# Altium schematic sheet 02 - Power.SchDoc: Power Supply
size A4; DrawnBy: Trevor Charmley; DocumentNumber: 4; Revision: 1; SheetNumber: 4; SheetTotal: 8
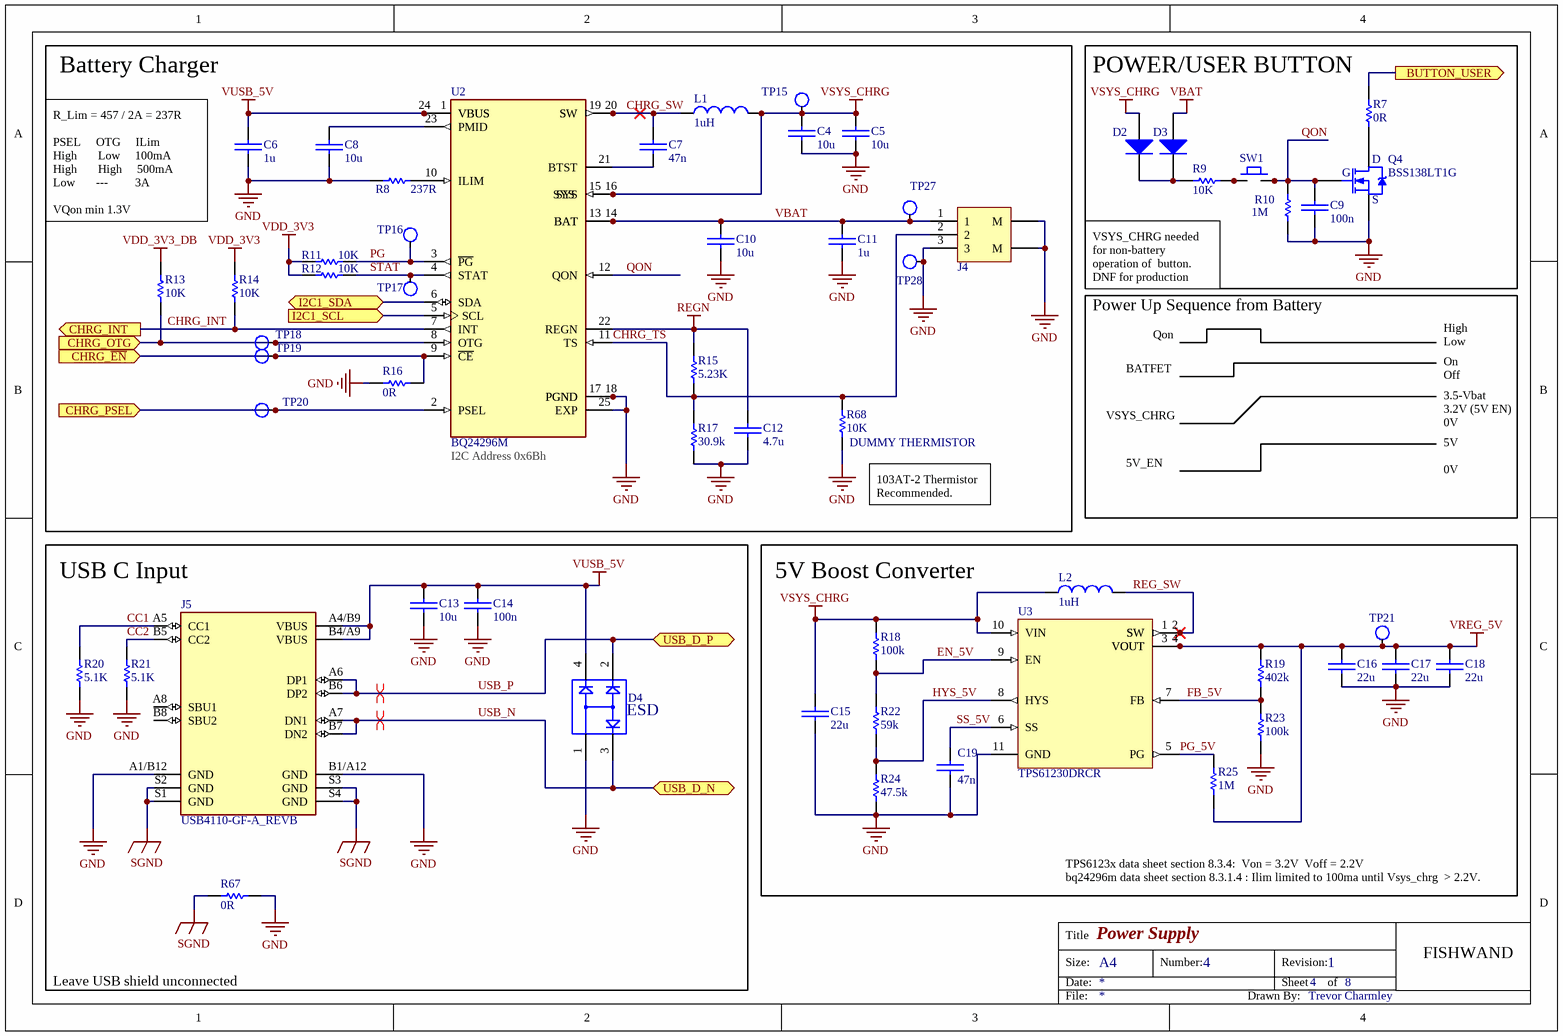
[diagram p0: 02 - Power.SchDoc]

## Parts
C4  10u  [CAPC100X50X65]
C5  10u  [CAPC100X50X65]
C6  1u  [CAPC100X50X65]
C7  47n  [CAPC100X50X65]
C8  10u  [CAPC100X50X65]
C9  100n  [CAPC100X50X65]
C10  10u  [CAPC100X50X65]
C11  1u  [CAPC100X50X65]
C12  4.7u  [CAPC100X50X65]
C13  10u  [CAPC100X50X65]
C14  100n  [CAPC100X50X65]
C15  22u  [CAPC200X125X140L45N]
C16  22u  [CAPC200X125X140L45N]
C17  22u  [CAPC200X125X140L45N]
C18  22u  [CAPC200X125X140L45N]
C19  47n  [CAPC100X50X65]
D2  Diode  [D_SOD_323F]  (value not drawn)
D3  Diode  [D_SOD_323F]  (value not drawn)
D4  SP0503BAHTG_8.5V_TVS_DIODE  [SOT143]  (value not drawn)
J4  BM03B-ADHKS-GAN-ETB  [J_JST_BM03B-ADHKS-GAN-ETB]  (value not drawn)
J5  USB4110-GF-A_REVB  [GCT_USB4110-GF-A_REVB]
L1  1uH  [IND1210]
L2  1uH  [IND1210]
Q4  BSS138LT1G  [SOT23-3P95_240X111L42X43N]
R7  0R  [RESC0402]
R8  237R  [RESC0402]
R9  10K  [RESC0402]
R10  1M  [RESC0402]
R11  10K  [RESC0402]
R12  10K  [RESC0402]
R13  10K  [RESC0402]
R14  10K  [RESC0402]
R15  5.23K  [RESC0402]
R16  0R  [RESC0402]
R17  30.9k  [RESC0402]
R18  100k  [RESC0402]
R19  402k  [RESC0402]
R20  5.1K  [RESC0402]
R21  5.1K  [RESC0402]
R22  59k  [RESC0402]
R23  100k  [RESC0402]
R24  47.5k  [RESC0402]
R25  1M  [RESC0402]
R67  0R  [RESC0402]
R68  10K  [RESC0402]
SW1  KSC621GLFS  [SW_KSC621GLFS]  (value not drawn)  (net tie)
TP15  Test Point  [tp_1mm]  (value not drawn)  (no BOM)
TP16  Test Point  [tp_1mm]  (value not drawn)  (no BOM)
TP17  Test Point  [tp_1mm]  (value not drawn)  (no BOM)
TP18  Test Point  [tp_1mm]  (value not drawn)  (no BOM)
TP19  Test Point  [tp_1mm]  (value not drawn)  (no BOM)
TP20  Test Point  [tp_1mm]  (value not drawn)  (no BOM)
TP21  Test Point  [tp_1mm]  (value not drawn)  (no BOM)
TP27  Test Point  [tp_1mm]  (value not drawn)  (no BOM)
TP28  Test Point  [tp_1mm]  (value not drawn)  (no BOM)
U2  BQ24296M  [QFN50P400X400X100-25N]
U3  TPS61230DRCR  [VREG_V62/16624-01YE]

## Blocks framed on the sheet
Battery Charger: C4-C8 C10-C12 J4 L1 R8 R11-R17 R68 TP15-TP20 TP27 TP28 U2
POWER/USER BUTTON: C9 D2 D3 Q4 R7 R9 R10 SW1
USB C Input: C13 C14 D4 J5 R20 R21 R67
5V Boost Converter: C15-C19 L2 R18 R19 R22-R25 TP21 U3

## Ports
BUTTON_USER (out), CHRG_INT (out), CHRG_OTG (in), CHRG_PSEL (in), CHRG_~{EN} (in), I2C1_SCL (in), I2C1_SDA (bidir), USB_D_N, USB_D_P

## Nets
GND: C4.2 C5.2 C6.2 C8.1 C9.2 C10.2 C11.2 C12.1 C13.2 C14.2 C15.1 C16.1 C17.1 C18.1 C19.2 D4.1 J4.0(M) J4.3 J5.A1/B12(GND) J5.B1/A12(GND) Q4.2(S) R8.1 R10.1 R16.1 R17.1 R20.1 R21.1 R23.1 R24.1 R67.2 R68.1 TP28.1 U2.17(PGND) U2.18(PGND) U2.25(EXP) U3.11(GND)
REGN: C12.2 R15.2 U2.22(REGN)
SGND: J5.S1(GND) J5.S2(GND) J5.S3(GND) J5.S4(GND) R67.1
VBAT: C10.1 C11.1 D3.2(A) J4.1 TP27.1 U2.13(BAT) U2.14(BAT)
VDD_3V3: R11.2 R12.2 R14.2
VDD_3V3_DB: R13.2
VREG_5V: C16.2 C17.2 C18.2 R19.2 R25.1 TP21.1 U3.3(VOUT) U3.4(VOUT)
VSYS_CHRG: C4.1 C5.1 C15.2 D2.2(A) L1.2 L2.1 R18.2 TP15.1 U2.15(SYS) U2.16(SYS) U3.10(VIN)
VUSB_5V: C6.1 C13.1 C14.1 D4.4 J5.A4/B9(VBUS) J5.B4/A9(VBUS) U2.1(VBUS) U2.24(VBUS)
BUTTON_USER: R7.1 ; port BUTTON_USER
CC1: J5.A5(CC1) R20.2
CC2: J5.B5(CC2) R21.2
CHRG_~{EN}: R16.2 TP19.1 U2.9(~{CE}) ; port CHRG_~{EN}
CHRG_INT: R14.1 U2.7(INT) ; port CHRG_INT
CHRG_OTG: R13.1 TP18.1 U2.8(OTG) ; port CHRG_OTG
CHRG_PSEL: TP20.1 U2.2(PSEL) ; port CHRG_PSEL
CHRG_SW: C7.1 L1.1 U2.19(SW) U2.20(SW)
CHRG_TS: J4.2 R15.1 R17.2 R68.2 U2.11(TS)
EN_5V: R18.1 R22.2 U3.9(EN)
FB_5V: R19.1 R23.2 U3.7(FB)
HYS_5V: R22.1 R24.2 U3.8(HYS)
I2C1_SCL: U2.5(SCL) ; port I2C1_SCL
I2C1_SDA: U2.6(SDA) ; port I2C1_SDA
PG: R11.1 TP16.1 U2.3(~{PG})
PG_5V: R25.2 U3.5(PG)
QON: C9.1 Q4.1(G) R10.2 SW1.2 SW1.4 U2.12(QON)
REG_SW: L2.2 U3.1(SW) U3.2(SW)
SS_5V: C19.1 U3.6(SS)
STAT: R12.1 TP17.1 U2.4(STAT)
USB_N: D4.3 J5.A7(DN1) J5.B7(DN2) ; port USB_D_N
USB_P: D4.2 J5.A6(DP1) J5.B6(DP2) ; port USB_D_P
NetC7_2: C7.2 U2.21(BTST)
NetC8_2: C8.2 U2.23(PMID)
NetD2_1: D2.1(K) D3.1(K) R9.2
NetQ4_3: Q4.3(D) R7.2
NetR8_2: R8.2 U2.10(ILIM)
NetR9_1: R9.1 SW1.1 SW1.3

Not connected (* = marked no-connect by the designer): J5 A8(SBU1) B8(SBU2)

## Layout directives
differential pair: USB_N, USB_P

## Notes on the sheet
- R_Lim = 457 / 2A = 237R
  PSEL     OTG     ILim
  High       Low     100mA
  High       High     500mA
  Low       ---         3A
  VQon min 1.3V
- VSYS_CHRG needed for non-battery operation of  button. DNF for production
- Power Up Sequence from Battery
- BATFET
- Qon
- High
- Low
- On
- Off
- (near R68) DUMMY THERMISTOR
- VSYS_CHRG
- 3.5-Vbat
- 3.2V (5V EN)
- 5V
- 0V
- (near U2) I2C Address 0x6Bh
- (near R68) 103AT-2 Thermistor Recommended.
- 5V_EN
- (near D4) ESD
- TPS6123x data sheet section 8.3.4:  Von = 3.2V  Voff = 2.2V
  bq24296m data sheet section 8.3.1.4 : Ilim limited to 100ma until Vsys_chrg  > 2.2V.
- Leave USB shield unconnected
- Title
- Size:
- Date:
- A4
- Number:
- Revision:
- Sheet
- of
- FISHWAND
- File:
- Drawn By:

## Library data of the parts
C4 C5 C8 C10 C13 = C_10UF_10V_X5R_0402: CAP CER 10UF 10V X5R 0402; Manufacturer: Samsung Electro-Mechanics; Manufacturer PN: CL05A106MP5NUNC; Supplier PN: 1276-1450-1-ND
C6 C11 = C_1UF_25V_X5R_0402_1: CAP CER 1UF 25V X5R 0402; Manufacturer: Murata Electronics North America; Manufacturer PN: GRT155R61E105KE01D; Supplier PN: 490-12263-2-ND
C7 C19 = C_47nF_25V_XR7_10%_0402: CAP CER 0.047UF 25V X7R 0402; Manufacturer: Murata Electronics; Manufacturer PN: GRM155R71E473KA88D; Value: 47nF; Supplier: Digi-Key; Supplier PN: 490-3254-2-ND
C9 C14 = C_100NF_25V_X5R_0402: CAP CER 100nF 25V X5R 0402; Manufacturer: Murata Electronics; Manufacturer PN: GRM155R61E104KA87D; Supplier: Digi-Key; Supplier PN: 490-5920-2-ND
C12 = C_4.7UF_10V_X5R_0402: CAP CER 4.7UF 10V X5R 0402; Manufacturer: Murata Electronics North America; Manufacturer PN: GRM155R61A475MEAAD; Supplier PN: 490-14306-1-ND
C15-C18 = C_22uF_10V_0805_20%: CAP CER 22UF 10V X5R 0805; Manufacturer PN: GRM21BR61A226ME51L; Manufacturer: Murata Electronics North America; RoHS: YES; Type: Cer; Supplier PN: 490-10511-1-ND; Value: 22uF
D2 D3 = D_SOD_323_75V_150mA: DIODE GEN PURP 75V 150MA SOD323F; Manufacturer: onsemi; Manufacturer PN: 1N4148WS; Supplier: *; Supplier PN: *; Package / Case: SC-90, SOD-323F
D4 = SP0503BAHTG_8.5V_TVS_DIODE: 8.5V Clamp Ipp Tvs Diode Surface Mount SOT-143-4; Manufacturer: Littelfuse Inc.; Manufacturer PN: SP0503BAHTG; SnapEDA_Link: https://www.snapeda.com/parts/SP0503BAHTG/Littelfuse%20Inc./view-part/214427/?ref=snap; Digi-Key_Purchase_URL: https://www.digikey.com/product-detail/en/littelfuse-inc/SP0503BAHTG/F2715CT-ND/1154322?utm_source=snapeda&utm_medium=aggregator&utm_campaign=symbol; Value: *; Digi-Key_Part_Number: F2715CT-ND; Package / Case: SOT-143 Littelfuse
J4 = CONN _HEADER SMD_3POS_1.3MM: CONN HEADER SMD R/A 3POS 1.3MM; Manufacturer: JST Sales America Inc.; Manufacturer PN: BM03B-ADHKS-GAN-ETB; Supplier: Digi-Key; Supplier PN: 455-2900-1-ND; ComponentLink1Description: Datasheet; ComponentLink1URL: http://www.jst-mfg.com/product/pdf/eng/eADH.pdf
J5 = USB4110-GF-A_REVB: USB-C (USB TYPE-C) USB 2.0 Receptacle Connector 24 (16+8 Dummy) Position Surface Mount, Right Angle; Through Hole; Manufacturer: GCT; Value: *; Price: 1.41; SnapEDA_Link: https://www.snapeda.com/parts/USB4110-GF-A/Global%20Connector%20Technology/view-part/4001167/?ref=snap; Availability: Warning; Check_prices: https://www.snapeda.com/parts/USB4110-GF-A/Global%20Connector%20Technology/view-part/4001167/?ref=eda; Manufacturer PN: USB4110-GF-A; Supplier: Digi-Key; Supplier PN: 2073-USB4110-GF-A-2-ND; Package / Case: USB TYPE-C
L1 L2 = L_1210_1uH_5.5A: 1 µH Shielded Drum Core, Wirewound Inductor 5.5 A 32mOhm Max 1210 (3225 Metric); Manufacturer: Bourns Inc.; Manufacturer PN: SRP3212-1R0M; Tolerance: 20%; Supplier: Digi-Key; Supplier PN: 118-SRP3212-1R0MTR-ND; Value: 1uH; Package / Case: 1210 (3225 Metric)
Q4 = TRANS_MOSFET_N_50V_200MA_SOT23: MOSFET N-CH 50V 200MA SOT-23; Manufacturer: ON Semiconductor; Manufacturer PN: BSS138LT1G; Type: MOSFET N-CH; Supplier PN: BSS138LT1GOSCT-ND
R7 R16 R67 = R_0402_0R_5%: 0 Ohms Jumper 0.063W, 1/16W Chip Resistor 0402 (1005 Metric) Thick Film; Manufacturer: YAGEO; Manufacturer PN: RC0402JR-070RP; Tolerance: 5%; Supplier: *; Supplier PN: *; Value: 0R; Package / Case: 0402
R8 = R_0402_237R_1%: 237 Ohms ±1% 0.063W, 1/16W Chip Resistor 0402 (1005 Metric) Moisture Resistant Thick Film; Manufacturer: YAGEO; Manufacturer PN: RC0402FR-07237RL; Supplier: Digi-Key; Supplier PN: YAG3065TR-ND; Value: 237R; Tolerance: 1%; Package / Case: 0402
R9 R11-R14 R68 = R_0402_10K_1%: 10 kOhms ±1% 0.063W, 1/16W Chip Resistor 0402 (1005 Metric) Moisture Resistant Thick Film; Manufacturer: YAGEO; Manufacturer PN: RC0402FR-0710KL; Supplier: *; Supplier PN: *; Value: 10K; Tolerance: 1%; Package / Case: 0402
R10 R25 = R_0402_1M_1%: 1 MOhms ±1% 0.063W, 1/16W Chip Resistor 0402 (1005 Metric) Moisture Resistant Thick Film; Manufacturer: YAGEO; Manufacturer PN: RC0402FR-071ML; Supplier: Digi-Key; Supplier PN: 311-1.00MLRTR-ND; Value: 1M; Tolerance: 1%; Package / Case: 0402
R15 = R_0402_5.23k_1%: 5.23 kOhms ±1% 0.063W, 1/16W Chip Resistor 0402 (1005 Metric) Moisture Resistant Thick Film; Manufacturer: YAGEO; Manufacturer PN: RC0402FR-075K23L; Supplier: Digi-Key; Supplier PN: YAG3195TR-ND; Value: 5.23K; Tolerance: 1%; Package / Case: 0402
R17 = R_0402_30.9k_1%: RES 30.9K OHM 1% 1/16W 0402; Manufacturer: YAGEO; Manufacturer PN: RC0402FR-0730K9L; Supplier: Digi-Key; Supplier PN: YAG3110TR-ND; Value: 30.9K; Tolerance: 1%; Package / Case: 0402
R18 R23 = R_0402_100k_1%: 100 kOhms ±1% 0.063W, 1/16W Chip Resistor 0402 (1005 Metric) Moisture Resistant Thick Film; Manufacturer: YAGEO; Manufacturer PN: RC0402FR-07100KL; Supplier: Digi-Key; Supplier PN: 311-100KLRTR-ND; Value: 100k; Tolerance: 1%; Package / Case: 0402
R19 = R_0402_402k_1%: 402 kOhms ±1% 0.063W, 1/16W Chip Resistor 0402 (1005 Metric) Moisture Resistant Thick Film; Manufacturer: YAGEO; Manufacturer PN: RC0402FR-07402KL; Supplier: Digi-Key; Supplier PN: YAG3151TR-ND; Value: 402k; Tolerance: 1%; Package / Case: 0402
R20 R21 = R_0402_5.1K_1%_1: 5.1 kOhms ±1% 0.063W, 1/16W Chip Resistor 0402 (1005 Metric) Moisture Resistant Thick Film; Manufacturer: YAGEO; Manufacturer PN: RC0402FR-075K1L; Supplier: Digi-Key; Supplier PN: 311-5.10KLRTR-ND; Value: 5.1K; Tolerance: 1%; Package / Case: 0402
R22 = R_0402_59k_1%: 59 kOhms ±1% 0.063W, 1/16W Chip Resistor 0402 (1005 Metric) Moisture Resistant Thick Film; Manufacturer: YAGEO; Manufacturer PN: RC0402FR-0759KL; Supplier: Digi-Key; Supplier PN: 311-59KLRTR-ND; Value: 59k; Package / Case: 0402
R24 = R_0402_47.5K_1%: 47.5 kOhms ±1% 0.063W, 1/16W Chip Resistor 0402 (1005 Metric) Moisture Resistant Thick Film; Manufacturer: YAGEO; Manufacturer PN: RC0402FR-0747K5L; Supplier: *; Supplier PN: *; Value: 47.5k; Tolerance: 1%; Package / Case: 0402
SW1 = SWITCH_TACTILE_SPST-NO_0.05A_32V: Manufacturer: C&K; Manufacturer PN: KSC621GLFS; Supplier PN: 401-1786-2-ND; Supplier: Digi-Key
TP15-TP21 TP27 TP28 = TP_1mm
U2 = BQ24296MRGER: Charger IC Lithium Ion/Polymer 24-VQFN (4x4); Manufacturer: TI; Price: 4.05; Availability: Unavailable; Package / Case: VQFN-24; Supplier PN: 595-BQ24296MRGER; Manufacturer PN: BQ24296MRGER; Supplier: Mouser
U3 = U_Vreg_5V_TPS61230DRCR: High Efficiency Synchronous Boost Converter With 5-A Switch 10-VSON -40 to 85; Manufacturer: Texas Instruments; Value: *; Availability: Unavailable; Package / Case: VSON-10 Texas Instruments; Texas_Instruments-Purchase-URL: https://snapeda.com/shop?store=Texas+Instruments&id=51762; Price: None; SnapEDA_Link: https://www.snapeda.com/parts/TPS61230DRCR/Texas%20Instruments/view-part/51762/?ref=snap; BuyPart: https://www.snapeda.com/parts/TPS61230DRCR/Texas%20Instruments/view-part/51762/?ref=eda; Supplier: Digi-Key; Supplier PN: 296-37761-2-ND; Manufacturer PN: TPS61230DRCR